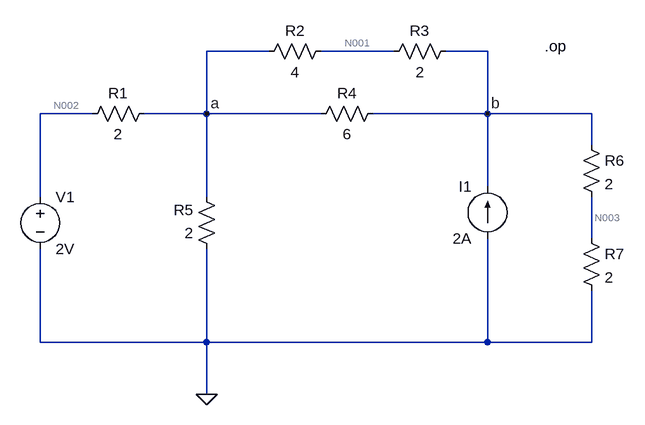
[diagram p0: schematic Circuit.asc]
Circuit.asc, the LTspice schematic file:
Version 4
SHEET 1 880 680
WIRE 256 -16 160 -16
WIRE 448 -16 336 -16
WIRE 592 -16 528 -16
WIRE -16 80 -96 80
WIRE 160 80 160 -16
WIRE 160 80 64 80
WIRE 336 80 160 80
WIRE 592 80 592 -16
WIRE 592 80 416 80
WIRE 752 80 592 80
WIRE 752 128 752 80
WIRE 592 192 592 80
WIRE -96 208 -96 80
WIRE 160 208 160 80
WIRE 752 272 752 208
WIRE -96 432 -96 288
WIRE 160 432 160 288
WIRE 160 432 -96 432
WIRE 592 432 592 272
WIRE 592 432 160 432
WIRE 752 432 752 352
WIRE 752 432 592 432
WIRE 160 512 160 432
FLAG 160 512 0
FLAG 160 80 a
FLAG 592 80 b
SYMBOL current 592 272 R180
WINDOW 0 24 80 Left 2
WINDOW 3 24 0 Left 2
SYMATTR InstName I1
SYMATTR Value 2A
SYMBOL voltage -96 192 R0
SYMATTR InstName V1
SYMATTR Value 2V
SYMBOL res 352 -32 R90
WINDOW 0 0 56 VBottom 2
WINDOW 3 32 56 VTop 2
SYMATTR InstName R2
SYMATTR Value 4
SYMBOL res 544 -32 R90
WINDOW 0 0 56 VBottom 2
WINDOW 3 32 56 VTop 2
SYMATTR InstName R3
SYMATTR Value 2
SYMBOL res 432 64 R90
WINDOW 0 0 56 VBottom 2
WINDOW 3 32 56 VTop 2
SYMATTR InstName R4
SYMATTR Value 6
SYMBOL res 176 304 R180
WINDOW 0 36 76 Left 2
WINDOW 3 36 40 Left 2
SYMATTR InstName R5
SYMATTR Value 2
SYMBOL res 80 64 R90
WINDOW 0 0 56 VBottom 2
WINDOW 3 32 56 VTop 2
SYMATTR InstName R1
SYMATTR Value 2
SYMBOL res 736 112 R0
SYMATTR InstName R6
SYMATTR Value 2
SYMBOL res 736 256 R0
SYMATTR InstName R7
SYMATTR Value 2
TEXT 680 -24 Left 2 !.op

The netlist it stands for:
* Circuit.asc
I1 0 b 2A
V1 N002 0 2V
R2 N001 a 4
R3 b N001 2
R4 b a 6
R5 0 a 2
R1 a N002 2
R6 b N003 2
R7 N003 0 2
.op
.backanno
.end

* Results of the author's LTspice run, read from the files saved beside the schematic
* Operating Point:
*   V(b) = 4.5 V
*   V(n002) = 2 V
*   V(n001) = 3.625 V
*   V(a) = 1.875 V
*   V(n003) = 2.25 V
*   I(I1) = 2 A
*   I(R7) = 1.125 A
*   I(R6) = 1.125 A
*   I(R1) = -62.5 mA
*   I(R5) = -937.5 mA
*   I(R4) = 437.5 mA
*   I(R3) = 437.5 mA
*   I(R2) = 437.5 mA
*   I(V1) = -62.5 mA